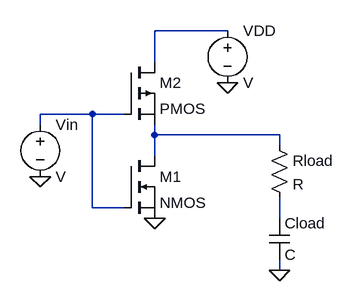
[diagram p0: schematic part_a_CMOS_Inverter_Schematic.asc]
part_a_CMOS_Inverter_Schematic.asc, the LTspice schematic file:
Version 4.1
SHEET 1 880 680
WIRE 288 -96 176 -96
WIRE 176 -48 176 -96
WIRE 80 32 0 32
WIRE 128 32 80 32
WIRE 0 48 0 32
WIRE 176 64 176 48
WIRE 368 64 176 64
WIRE 368 80 368 64
WIRE 176 96 176 64
WIRE 80 176 80 32
WIRE 128 176 80 176
WIRE 368 192 368 160
WIRE 368 272 368 256
FLAG 288 -16 0
FLAG 0 128 0
FLAG 368 272 0
FLAG 176 192 0
SYMBOL nmos 128 96 R0
SYMATTR InstName M1
SYMBOL pmos 128 -48 R0
SYMATTR InstName M2
SYMBOL voltage 288 -112 R0
SYMATTR InstName VDD
SYMBOL voltage 0 32 R0
SYMATTR InstName Vin
SYMBOL res 352 64 R0
SYMATTR InstName Rload
SYMBOL cap 352 192 R0
SYMATTR InstName Cload

The netlist it stands for:
* part_a_CMOS_Inverter_Schematic.asc
M1 N003 N002 0 0 NMOS
M2 N001 N002 N003 N003 PMOS
VDD N001 0 V
Vin N002 0 V
Rload N003 N004 R
Cload N004 0 C
.model NMOS NMOS
.model PMOS PMOS
.lib standard.mos
.backanno
.end